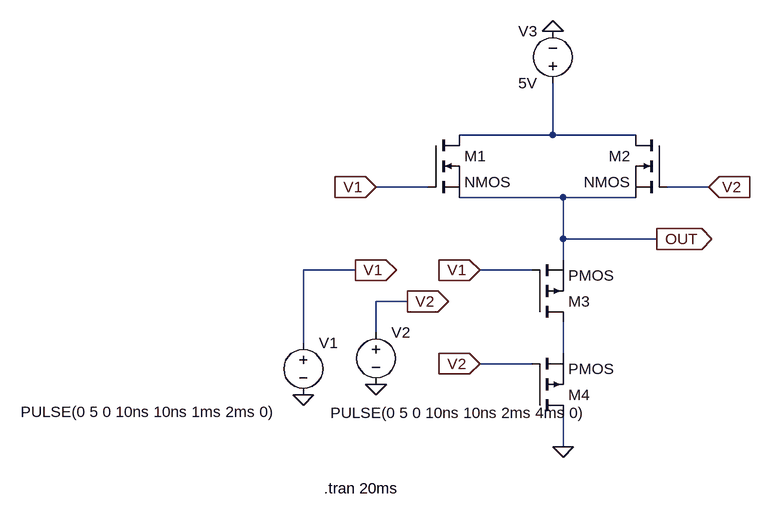
[diagram p0: schematic PorteOR.asc]
PorteOR.asc, the LTspice schematic file:
Version 4
SHEET 1 880 680
WIRE 288 16 288 -64
WIRE 288 16 144 16
WIRE 416 16 288 16
WIRE 96 96 16 96
WIRE 528 96 464 96
WIRE 304 112 144 112
WIRE 416 112 304 112
WIRE 304 176 304 112
WIRE 448 176 304 176
WIRE 304 208 304 176
WIRE -16 224 -96 224
WIRE 256 224 176 224
WIRE 64 272 16 272
WIRE 16 320 16 272
WIRE -96 336 -96 224
WIRE 304 352 304 304
WIRE 256 368 176 368
WIRE 304 496 304 448
FLAG 288 -144 0
FLAG 304 496 0
FLAG -96 416 0
FLAG 16 400 0
FLAG -16 224 V1
IOPIN -16 224 Out
FLAG 64 272 V2
IOPIN 64 272 Out
FLAG 448 176 OUT
IOPIN 448 176 Out
FLAG 16 96 V1
IOPIN 16 96 In
FLAG 528 96 V2
IOPIN 528 96 In
FLAG 176 224 V1
IOPIN 176 224 In
FLAG 176 368 V2
IOPIN 176 368 In
SYMBOL nmos 96 16 R0
SYMATTR InstName M1
SYMBOL nmos 464 16 M0
SYMATTR InstName M2
SYMBOL pmos 256 304 M180
SYMATTR InstName M3
SYMBOL pmos 256 448 M180
SYMATTR InstName M4
SYMBOL voltage -96 320 R0
WINDOW 3 -435 122 Left 2
WINDOW 123 0 0 Left 0
WINDOW 39 0 0 Left 0
SYMATTR InstName V1
SYMATTR Value PULSE(0 5 0 10ns 10ns 1ms 2ms 0)
SYMBOL voltage 16 304 R0
WINDOW 3 -70 140 Left 2
WINDOW 123 0 0 Left 0
WINDOW 39 0 0 Left 0
SYMATTR InstName V2
SYMATTR Value PULSE(0 5 0 10ns 10ns 2ms 4ms 0)
SYMBOL voltage 288 -48 R180
WINDOW 0 24 96 Left 2
WINDOW 3 24 16 Left 2
WINDOW 123 0 0 Left 0
WINDOW 39 0 0 Left 0
SYMATTR InstName V3
SYMATTR Value 5V
TEXT -64 560 Left 2 !.tran 20ms

The netlist it stands for:
* PorteOR.asc
M1 N001 V1 OUT OUT NMOS
M2 N001 V2 OUT OUT NMOS
M3 N002 V1 OUT OUT PMOS
M4 0 V2 N002 N002 PMOS
V1 V1 0 PULSE(0 5 0 10ns 10ns 1ms 2ms 0)
V2 V2 0 PULSE(0 5 0 10ns 10ns 2ms 4ms 0)
V3 N001 0 5V
.model NMOS NMOS
.model PMOS PMOS
.lib standard.mos
.tran 20ms
.backanno
.end

* Results of the author's LTspice run, read from the files saved beside the schematic
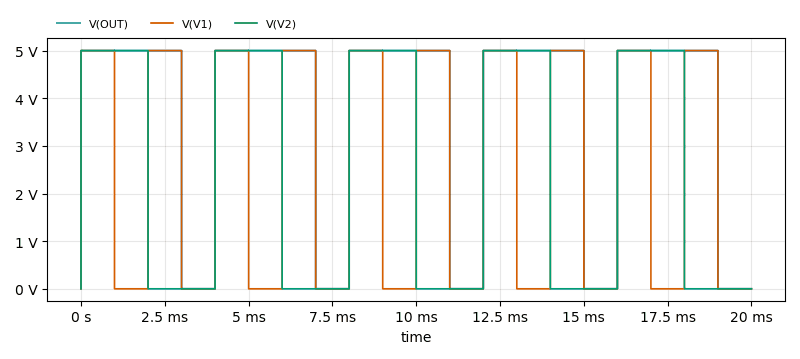
[diagram p1: Transient Analysis of PorteOR.asc, plotted from the saved traces]
* Transient Analysis, 1 run:
*   V(OUT): min 2 mV, max 5.005 V, average 3.75 V, rms 4.329 V, last 2 mV
*   V(V1): min 0 V, max 5 V, average 2.5 V, rms 3.536 V, last 0 V
*   V(V2): min 0 V, max 5 V, average 2.5 V, rms 3.536 V, last 0 V